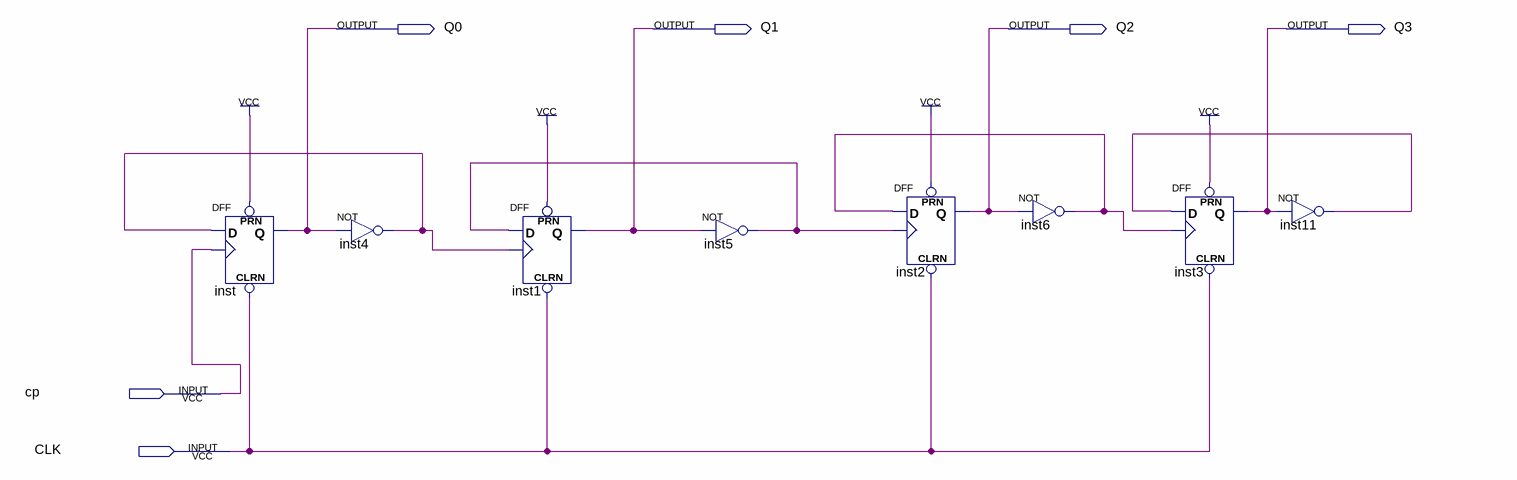
[diagram p0: schematic sheet]
// Quartus schematic test5.bdf as structural Verilog: 8 symbols, 6 pins
module test5 (
  input  cp,
  input  CLK,
  output Q0,
  output Q1,
  output Q2,
  output Q3
);

  wire inst4_out, inst5_out, inst6_out, inst11_out;

  DFF inst (.CLRN(CLK), .CLK(cp), .D(inst4_out), .PRN(1'b1), .Q(Q0));
  not inst4 (inst4_out, Q0);
  DFF inst1 (.CLRN(CLK), .CLK(inst4_out), .D(inst5_out), .PRN(1'b1), .Q(Q1));
  not inst5 (inst5_out, Q1);
  DFF inst2 (.CLRN(CLK), .CLK(inst5_out), .D(inst6_out), .PRN(1'b1), .Q(Q2));
  not inst6 (inst6_out, Q2);
  DFF inst3 (.CLRN(CLK), .CLK(inst6_out), .D(inst11_out), .PRN(1'b1), .Q(Q3));
  not inst11 (inst11_out, Q3);
endmodule
